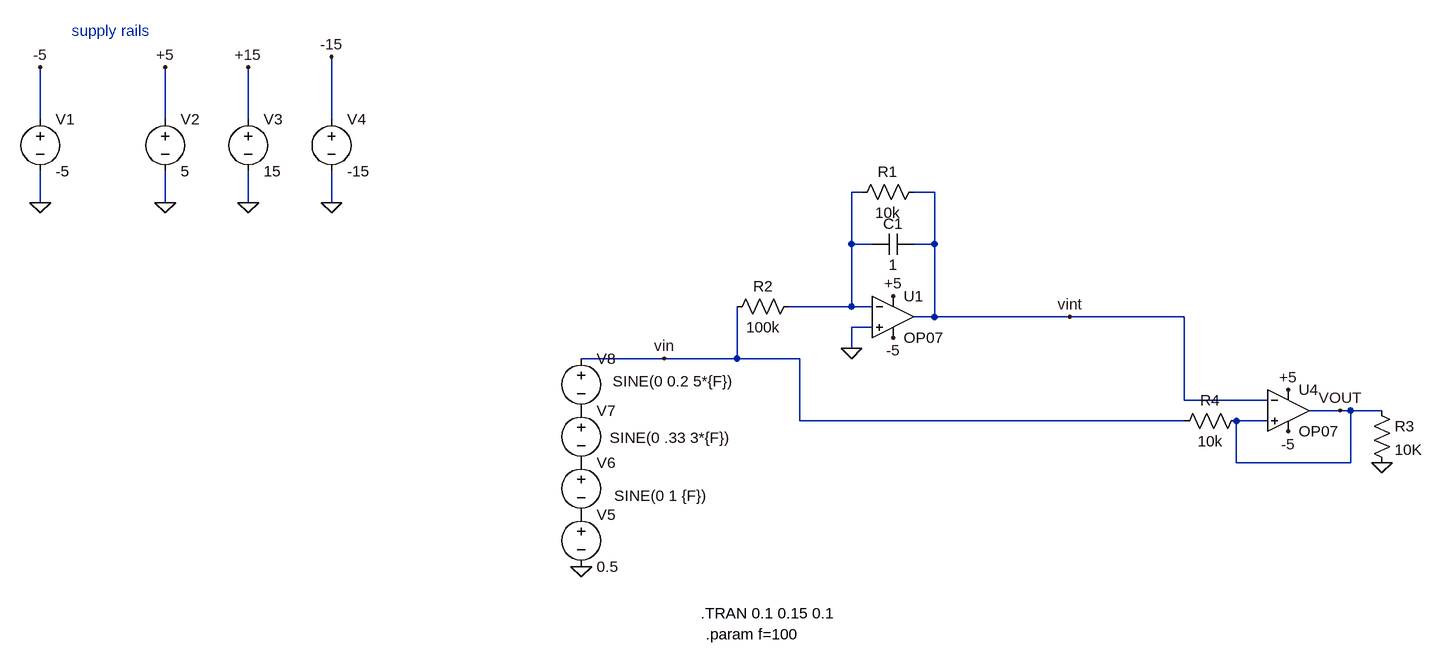
[diagram p0: schematic Draft1.asc]
Draft1.asc, the LTspice schematic file:
Version 4
SHEET 1 1620 840
WIRE -512 32 -512 -48
WIRE -320 32 -320 -48
WIRE -192 32 -192 -48
WIRE -64 32 -64 -64
WIRE 752 144 736 144
WIRE 864 144 832 144
WIRE -512 160 -512 112
WIRE -320 160 -320 112
WIRE -192 160 -192 112
WIRE -64 160 -64 112
WIRE 736 224 736 144
WIRE 768 224 736 224
WIRE 864 224 864 144
WIRE 864 224 832 224
WIRE 736 320 736 224
WIRE 736 320 640 320
WIRE 768 320 736 320
WIRE 864 336 864 224
WIRE 864 336 832 336
WIRE 1072 336 864 336
WIRE 1248 336 1072 336
WIRE 768 352 736 352
WIRE 736 384 736 352
WIRE 448 400 320 400
WIRE 560 400 560 320
WIRE 560 400 448 400
WIRE 656 400 560 400
WIRE 1248 464 1248 336
WIRE 1376 464 1248 464
WIRE 1488 480 1440 480
WIRE 1504 480 1488 480
WIRE 1552 480 1504 480
WIRE 656 496 656 400
WIRE 1248 496 656 496
WIRE 1376 496 1328 496
WIRE 1328 560 1328 496
WIRE 1504 560 1504 480
WIRE 1504 560 1328 560
FLAG -320 -48 +5
FLAG -512 -48 -5
FLAG -320 160 0
FLAG -512 160 0
FLAG -192 160 0
FLAG -64 160 0
FLAG -192 -48 +15
FLAG -64 -64 -15
FLAG 800 304 +5
FLAG 800 368 -5
FLAG 1408 448 +5
FLAG 1408 512 -5
FLAG 320 720 0
FLAG 1552 560 0
FLAG 1488 480 VOUT
FLAG 736 384 0
FLAG 1072 336 vint
FLAG 448 400 vin
SYMBOL Opamps/OP07 800 272 R0
SYMATTR InstName U1
SYMBOL voltage -512 16 R0
SYMATTR InstName V1
SYMATTR Value -5
SYMBOL voltage -320 16 R0
SYMATTR InstName V2
SYMATTR Value 5
SYMBOL voltage -192 16 R0
SYMATTR InstName V3
SYMATTR Value 15
SYMBOL voltage -64 16 R0
SYMATTR InstName V4
SYMATTR Value -15
SYMBOL Opamps/OP07 1408 416 R0
SYMATTR InstName U4
SYMBOL voltage 320 624 R0
SYMATTR InstName V5
SYMATTR Value 0.5
SYMBOL cap 832 208 R90
WINDOW 0 0 32 VBottom 2
WINDOW 3 32 32 VTop 2
SYMATTR InstName C1
SYMATTR Value 1
SYMBOL voltage 320 544 R0
WINDOW 3 51 67 Left 2
SYMATTR InstName V6
SYMATTR Value SINE(0 1 {F})
SYMBOL voltage 320 464 R0
WINDOW 3 44 58 Left 2
SYMATTR InstName V7
SYMATTR Value SINE(0 .33 3*{F})
SYMBOL voltage 320 384 R0
WINDOW 3 49 51 Left 2
SYMATTR InstName V8
SYMATTR Value SINE(0 0.2 5*{F})
SYMBOL res 1536 464 R0
SYMATTR InstName R3
SYMATTR Value 10K
SYMBOL res 848 128 R90
WINDOW 0 0 56 VBottom 2
WINDOW 3 32 56 VTop 2
SYMATTR InstName R1
SYMATTR Value 10k
SYMBOL res 656 304 R90
WINDOW 0 0 56 VBottom 2
WINDOW 3 32 56 VTop 2
SYMATTR InstName R2
SYMATTR Value 100k
SYMBOL res 1344 480 R90
WINDOW 0 0 56 VBottom 2
WINDOW 3 32 56 VTop 2
SYMATTR InstName R4
SYMATTR Value 10k
TEXT -464 -104 Left 2 ;supply rails
TEXT 504 792 Left 2 !.TRAN 0.1 0.15 0.1
TEXT 512 824 Left 2 !.param f=100

The netlist it stands for:
* Draft1.asc
XU1 0 N001 +5 -5 vint LT1001  ; OP07, pins In+ In- V+ V- OUT
V1 -5 0 -5
V2 +5 0 5
V3 +15 0 15
V4 -15 0 -15
XU4 VOUT vint +5 -5 VOUT LT1001  ; OP07, pins In+ In- V+ V- OUT
V5 P001 0 0.5
C1 vint N001 1
V6 P002 P001 SINE(0 1 {F})
V7 P003 P002 SINE(0 .33 3*{F})
V8 vin P003 SINE(0 0.2 5*{F})
R3 VOUT 0 10K
R1 vint N001 10k
R2 N001 vin 100k
R4 VOUT vin 10k
* supply rails
.TRAN 0.1 0.15 0.1
.param f=100
.lib LTC.lib
.backanno
.end